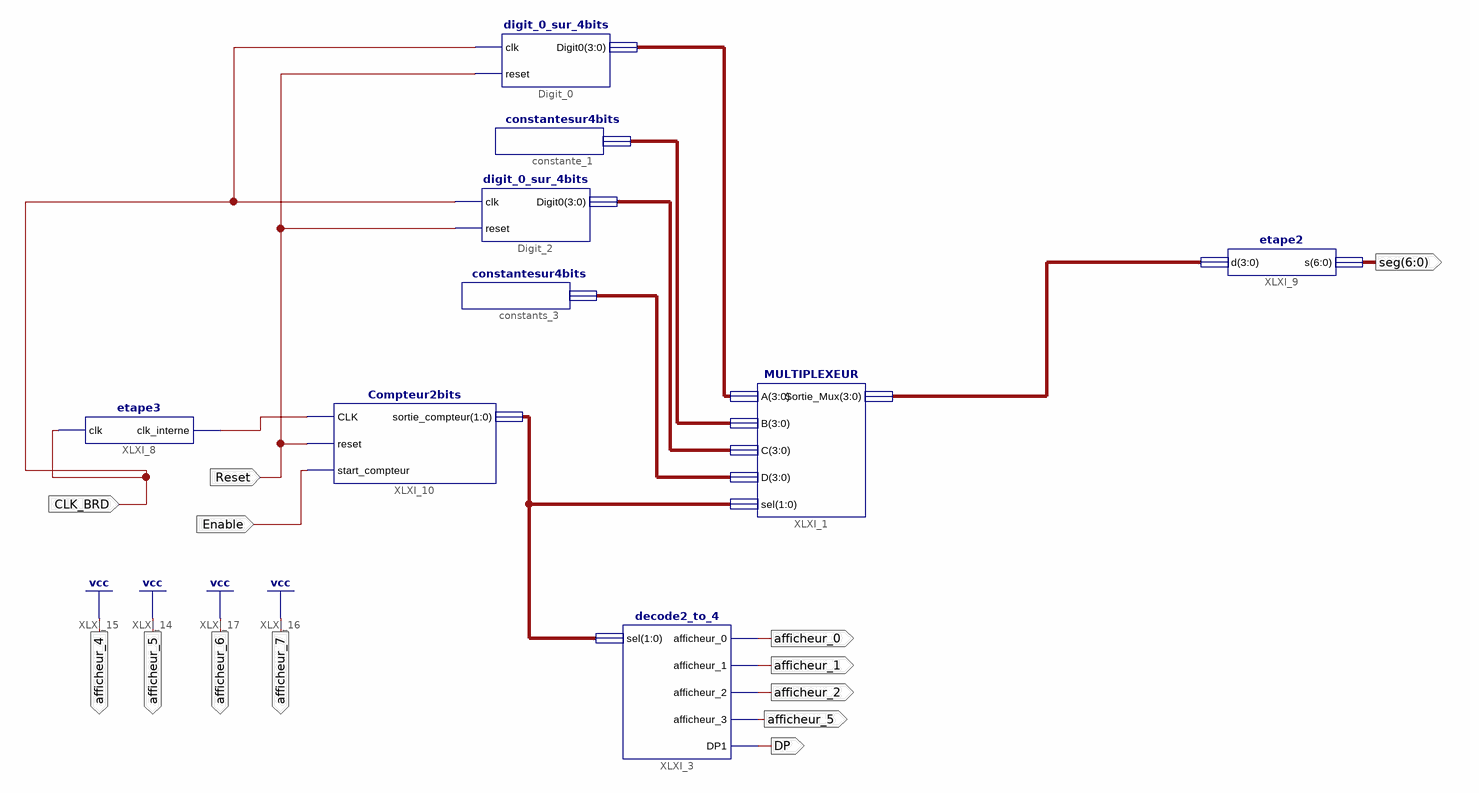
[diagram p0: schematic sheet 1]
// Xilinx ISE schematic divider_clock.sch (artix7) as structural Verilog: 9 symbols, 12 ports
module divider_clock (
  input  CLK_BRD,
  input  Reset,
  input  Enable,
  output afficheur_1,
  output afficheur_5,
  output DP,
  output afficheur_0,
  output afficheur_2,
  output afficheur_4,
  output afficheur_6,
  output afficheur_7,
  output [6:0] seg
);

  wire XLXN_16;
  wire [1:0] XLXN_11;
  wire [3:0] XLXN_1, XLXN_2, XLXN_7, XLXN_9, XLXN_10;

  MULTIPLEXEUR XLXI_1 (.A(XLXN_2), .B(XLXN_7), .C(XLXN_10), .D(XLXN_9), .sel(XLXN_11), .Sortie_Mux(XLXN_1));
  constantesur4bits constante_1 (.Cste_1(XLXN_7));
  decode2_to_4 XLXI_3 (
    .sel(XLXN_11), .afficheur_0(afficheur_0), .afficheur_1(afficheur_1), .afficheur_2(afficheur_2),
    .afficheur_3(1'b1), .DP1(DP));
  digit_0_sur_4bits Digit_0 (.clk(CLK_BRD), .reset(Reset), .Digit0(XLXN_2));
  constantesur4bits constants_3 (.Cste_1(XLXN_9));
  digit_0_sur_4bits Digit_2 (.clk(CLK_BRD), .reset(Reset), .Digit0(XLXN_10));
  etape3 XLXI_8 (.clk(CLK_BRD), .clk_interne(XLXN_16));
  etape2 XLXI_9 (.d(XLXN_1), .s(seg));
  Compteur2bits XLXI_10 (.CLK(XLXN_16), .reset(Reset), .start_compteur(Enable), .sortie_compteur(XLXN_11));

  assign afficheur_4 = 1'b1;
  assign afficheur_5 = 1'b1;
  assign afficheur_6 = 1'b1;
  assign afficheur_7 = 1'b1;
endmodule
